# Altium schematic sheet EXT-Camera-Interface.SchDoc
size A4; SheetNumber: 8; SheetTotal: 11
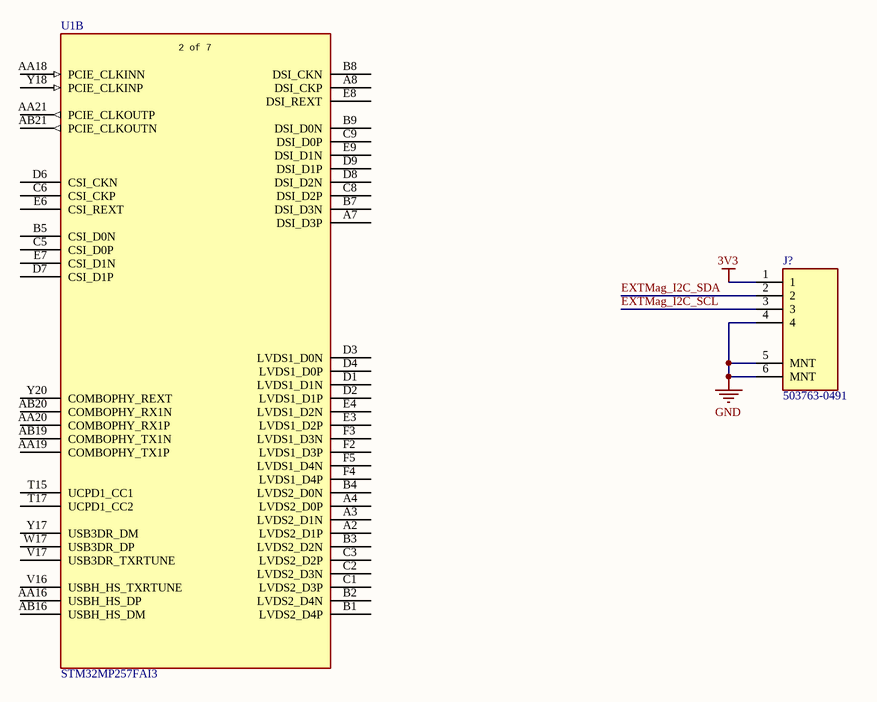
[diagram p0: EXT-Camera-Interface.SchDoc]

## Parts
J?  503763-0491  [5037630491]
U1  STM32MP257FAI3  [TFBGA436_STM]  (part B of 8)

## Nets
3V3: J?.1
GND: J?.4 J?.5(MNT) J?.6(MNT)
EXTMag_I2C_SCL: J?.3
EXTMag_I2C_SDA: J?.2

Not connected (* = marked no-connect by the designer): U1 A2(LVDS2_D1P) A3(LVDS2_D1N) A4(LVDS2_D0P) A7(DSI_D3P) A8(DSI_CKP) AA16(USBH_HS_DP) AA18(PCIE_CLKINN) AA19(COMBOPHY_TX1P) AA20(COMBOPHY_RX1P) AA21(PCIE_CLKOUTP) AB16(USBH_HS_DM) AB19(COMBOPHY_TX1N) AB20(COMBOPHY_RX1N) AB21(PCIE_CLKOUTN) B1(LVDS2_D4P) B2(LVDS2_D4N) B3(LVDS2_D2N) B4(LVDS2_D0N) B5(CSI_D0N) B7(DSI_D3N) B8(DSI_CKN) B9(DSI_D0N) C1(LVDS2_D3P) C2(LVDS2_D3N) C3(LVDS2_D2P) C5(CSI_D0P) C6(CSI_CKP) C8(DSI_D2P) C9(DSI_D0P) D1(LVDS1_D1N) D2(LVDS1_D1P) D3(LVDS1_D0N) D4(LVDS1_D0P) D6(CSI_CKN) D7(CSI_D1P) D8(DSI_D2N) D9(DSI_D1P) E3(LVDS1_D2P) E4(LVDS1_D2N) E6(CSI_REXT) E7(CSI_D1N) E8(DSI_REXT) E9(DSI_D1N) F2(LVDS1_D3P) F3(LVDS1_D3N) F4(LVDS1_D4P) F5(LVDS1_D4N) T15(UCPD1_CC1) T17(UCPD1_CC2) V16(USBH_HS_TXRTUNE) V17(USB3DR_TXRTUNE) W17(USB3DR_DP) Y17(USB3DR_DM) Y18(PCIE_CLKINP) Y20(COMBOPHY_REXT)

## Notes on the sheet
- (in symbol STM32MP257FAI3, part B) 2 of 7

## Library data of the parts
J? = 503763-0491: Connector; Manufacturer_Name: Molex; Datasheet Link: https://www.molex.com/webdocs/datasheets/pdf/en-us/5037630491_PCB_HEADERS.pdf; Height: 1mm; Manufacturer_Part_Number: 503763-0491; Mouser Part Number: 538-503763-0491; Mouser Price/Stock: https://www.mouser.co.uk/ProductDetail/Molex/503763-0491?qs=zwvsCB%2Fxu0cTZVAek%2FYVrQ%3D%3D
U1 = STM32MP257FAI3: MPU with Dual Arm Cortex-A35 @1.5GHz, Cortex-M33 @400MHz, 3xEthernet (2+1 switch), 3xFD-CAN, LVDS/DSI, H.264, 3D GPU, AI/NN, Secure Boot, Cryptography, DRAM enc/dec, PKA; Manufacturer_Name: STMicroelectronics; Copyright: Copyright (C) 2025 Ultra Librarian. All rights reserved.; Manufacturer_Part_Number: STM32MP257FAI3; RefDes: RefDes; Type: Type